# Altium schematic sheet mcu.SchDoc
size A4
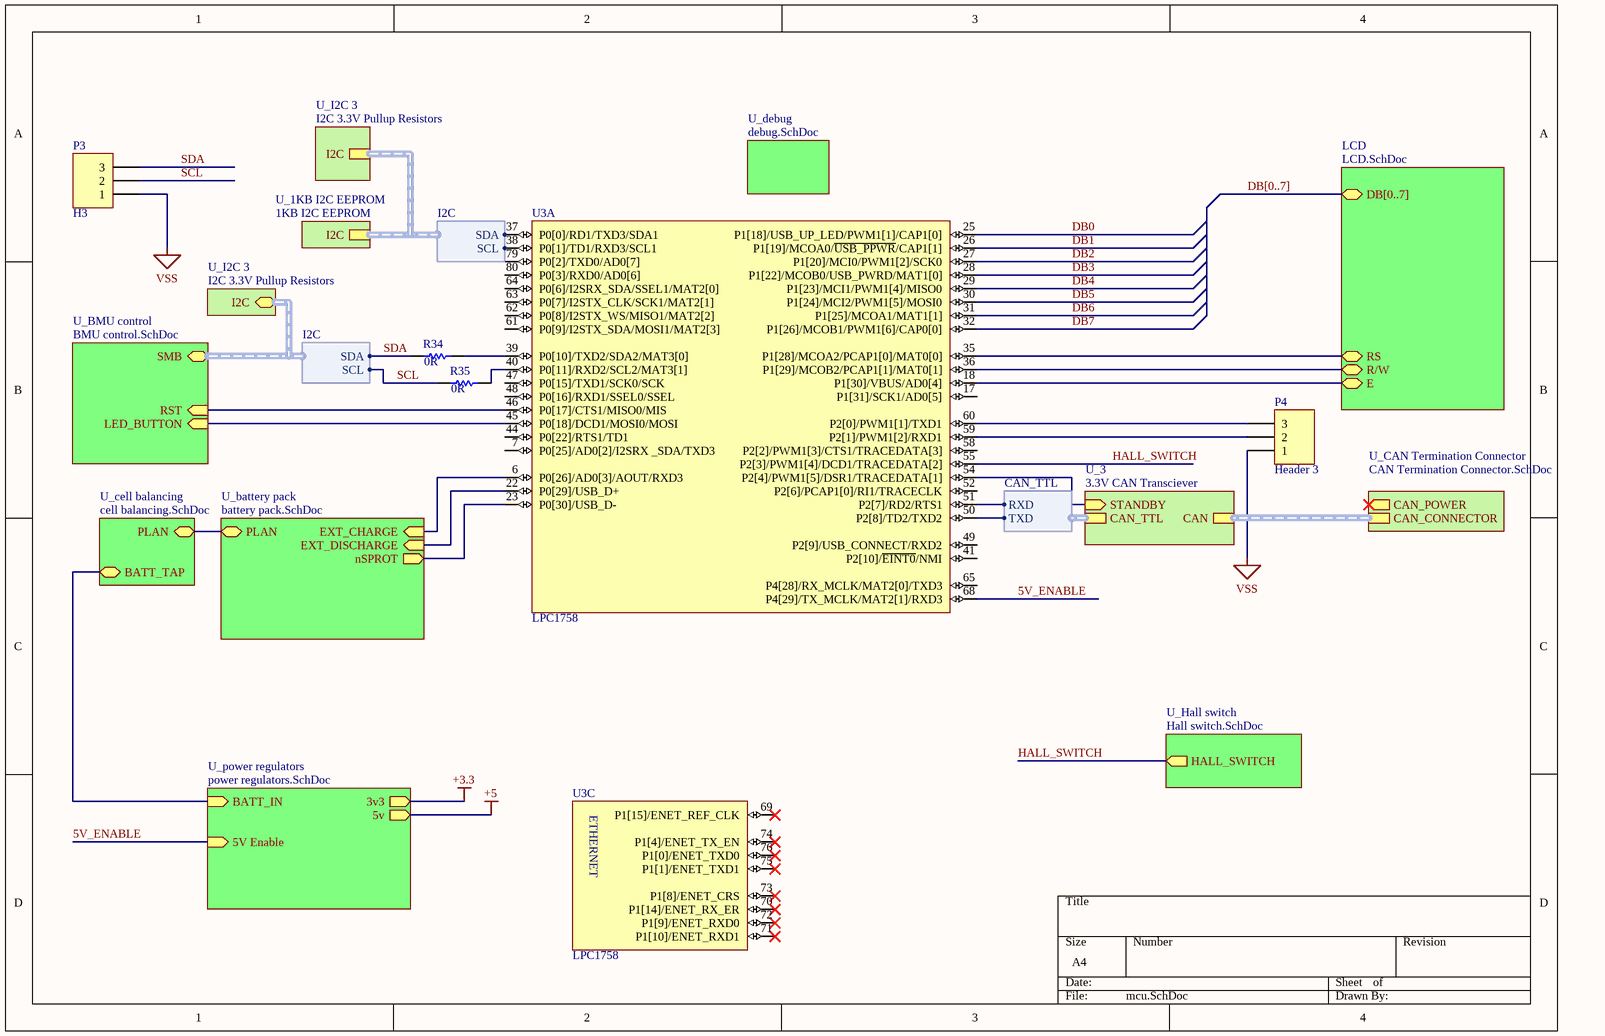
[diagram p0: mcu.SchDoc]

## Parts
P3  H3  [HDR1X3]
P4  Header 3  [HDR1X3]
R34  value 0R  [R0603]  (hidden comment: Res1)
R35  value 0R  [R0603]  (hidden comment: Res1)
U3  LPC1758  [LPC1758FBD80]  (parts A,C of 3)

## Sub-sheets
LCD = LCD.SchDoc: DB[0..7], E, R/W, RS
U_1KB I2C EEPROM = 1KB I2C EEPROM: I2C (harness I2C)
U_3 = 3.3V CAN Transciever: CAN_TTL (harness CAN_TTL), CAN (harness CAN), STANDBY (in)
U_battery pack = battery pack.SchDoc: PLAN (bidir), EXT_CHARGE (in), EXT_DISCHARGE (in), nSPROT (out)
U_BMU control = BMU control.SchDoc: RST (in), LED_BUTTON (in), SMB (harness I2C)
U_CAN Termination Connector = CAN Termination Connector.SchDoc: CAN_CONNECTOR (harness CAN), CAN_POWER (out)
U_cell balancing = cell balancing.SchDoc: PLAN (bidir), BATT_TAP
U_debug = debug.SchDoc: no entries
U_Hall switch = Hall switch.SchDoc: HALL_SWITCH (out)
U_I2C 3 = I2C 3.3V Pullup Resistors: I2C (harness I2C)
U_I2C 3 = I2C 3.3V Pullup Resistors: I2C (harness I2C)
U_power regulators = power regulators.SchDoc: BATT_IN, 3v3 (out), 5v, 5V Enable (in)

## Harnesses
CAN_TTL: RXD, TXD
I2C: SCL, SDA

## Nets
+3.3: sheet U_power regulators/3v3
+5: sheet U_power regulators/5v
VSS: P3.1 P4.1
5V_ENABLE: U3.68(P4[29]/TX_MCLK/MAT2[1]/RXD3) ; sheet U_power regulators/5V Enable
DB0: U3.25(P1[18]/USB_UP_LED/PWM1[1]/CAP1[0])
DB1: U3.26(P1[19]/MCOA0/~{USB_PPWR}/CAP1[1])
DB2: U3.27(P1[20]/MCI0/PWM1[2]/SCK0)
DB3: U3.28(P1[22]/MCOB0/USB_PWRD/MAT1[0])
DB4: U3.29(P1[23]/MCI1/PWM1[4]/MISO0)
DB5: U3.30(P1[24]/MCI2/PWM1[5]/MOSI0)
DB6: U3.31(P1[25]/MCOA1/MAT1[1])
DB7: U3.32(P1[26]/MCOB1/PWM1[6]/CAP0[0])
HALL_SWITCH: U3.55(P2[3]/PWM1[4]/DCD1/TRACEDATA[2]) ; sheet U_Hall switch/HALL_SWITCH
SCL: P3.2 R35.1 ; sheet U_BMU control/SMB.SCL
SDA: P3.3 R34.1 ; sheet U_BMU control/SMB.SDA
NetP4_2: P4.2 U3.59(P2[1]/PWM1[2]/RXD1)
NetP4_3: P4.3 U3.60(P2[0]/PWM1[1]/TXD1)
NetR34_2: R34.2 U3.39(P0[10]/TXD2/SDA2/MAT3[0])
NetR35_2: R35.2 U3.40(P0[11]/RXD2/SCL2/MAT3[1])
NetU3_6: U3.6(P0[26]/AD0[3]/AOUT/RXD3) ; sheet U_battery pack/EXT_CHARGE
NetU3_18: U3.18(P1[30]/VBUS/AD0[4]) ; sheet LCD/E
NetU3_22: U3.22(P0[29]/USB_D+) ; sheet U_battery pack/EXT_DISCHARGE
NetU3_23: U3.23(P0[30]/USB_D-) ; sheet U_battery pack/nSPROT
NetU3_35: U3.35(P1[28]/MCOA2/PCAP1[0]/MAT0[0]) ; sheet LCD/RS
NetU3_36: U3.36(P1[29]/MCOB2/PCAP1[1]/MAT0[1]) ; sheet LCD/R/W
NetU3_37: U3.37(P0[0]/RD1/TXD3/SDA1) ; sheet U_1KB I2C EEPROM/I2C.SDA
NetU3_38: U3.38(P0[1]/TD1/RXD3/SCL1) ; sheet U_1KB I2C EEPROM/I2C.SCL
NetU3_45: U3.45(P0[18]/DCD1/MOSI0/MOSI) ; sheet U_BMU control/LED_BUTTON
NetU3_46: U3.46(P0[17]/CTS1/MISO0/MIS) ; sheet U_BMU control/RST
NetU3_50: U3.50(P2[8]/TD2/TXD2) ; sheet U_3/CAN_TTL.TXD
NetU3_51: U3.51(P2[7]/RD2/RTS1) ; sheet U_3/CAN_TTL.RXD
NetU3_54: U3.54(P2[4]/PWM1[5]/DSR1/TRACEDATA[1]) ; sheet U_3/STANDBY
(unnamed): sheet U_battery pack/PLAN, sheet U_cell balancing/PLAN
(unnamed): sheet U_cell balancing/BATT_TAP, sheet U_power regulators/BATT_IN

Not connected (* = marked no-connect by the designer): U3 7(P0[25]/AD0[2]/I2SRX__SDA/TXD3) 17(P1[31]/SCK1/AD0[5]) 41(P2[10]/~{EINT0}/NMI) 44(P0[22]/RTS1/TD1) 47(P0[15]/TXD1/SCK0/SCK) 48(P0[16]/RXD1/SSEL0/SSEL) 49(P2[9]/USB_CONNECT/RXD2) 52(P2[6]/PCAP1[0]/RI1/TRACECLK) 58(P2[2]/PWM1[3]/CTS1/TRACEDATA[3]) 61(P0[9]/I2STX_SDA/MOSI1/MAT2[3]) 62(P0[8]/I2STX_WS/MISO1/MAT2[2]) 63(P0[7]/I2STX_CLK/SCK1/MAT2[1]) 64(P0[6]/I2SRX_SDA/SSEL1/MAT2[0]) 65(P4[28]/RX_MCLK/MAT2[0]/TXD3) 69(P1[15]/ENET_REF_CLK)* 70(P1[14]/ENET_RX_ER)* 71(P1[10]/ENET_RXD1)* 72(P1[9]/ENET_RXD0)* 73(P1[8]/ENET_CRS)* 74(P1[4]/ENET_TX_EN)* 75(P1[1]/ENET_TXD1)* 76(P1[0]/ENET_TXD0)* 79(P0[2]/TXD0/AD0[7]) 80(P0[3]/RXD0/AD0[6])

## Buses and harness runs
bus DB[0..7] = sheet LCD/DB[0..7]
harness sheet U_1KB I2C EEPROM/I2C = sheet U_I2C 3/I2C
harness sheet U_3/CAN = sheet U_CAN Termination Connector/CAN_CONNECTOR
harness sheet U_BMU control/SMB = sheet U_I2C 3/I2C

## Notes on the sheet
- (in symbol LPC1758, part C) ETHERNET

## Library data of the parts
P3 = TXS0108E: Header, 3-Pin; LatestRevisionDate: 17-Jul-2002; LatestRevisionNote: Re-released for DXP Platform.; Publisher: Altium Limited
P4 = Header 3: Header, 3-Pin; LatestRevisionDate: 17-Jul-2002; LatestRevisionNote: Re-released for DXP Platform.; Publisher: Altium Limited
R34 R35 = Res1: Resistor; Published: 8-Jun-2000; LatestRevisionDate: 17-Jul-2002; LatestRevisionNote: Re-released for DXP Platform.; PackageReference: AXIAL-0.3; Publisher: Altium Limited; farnell: 9331662
U3 = LPC1758: NXP - LPC1758FBD80 - MCU, 32BIT, ARM CORTEX M3, 80LQFP; farnell: 1718545